# Altium project Solar_ESC_AM32.PrjPcb
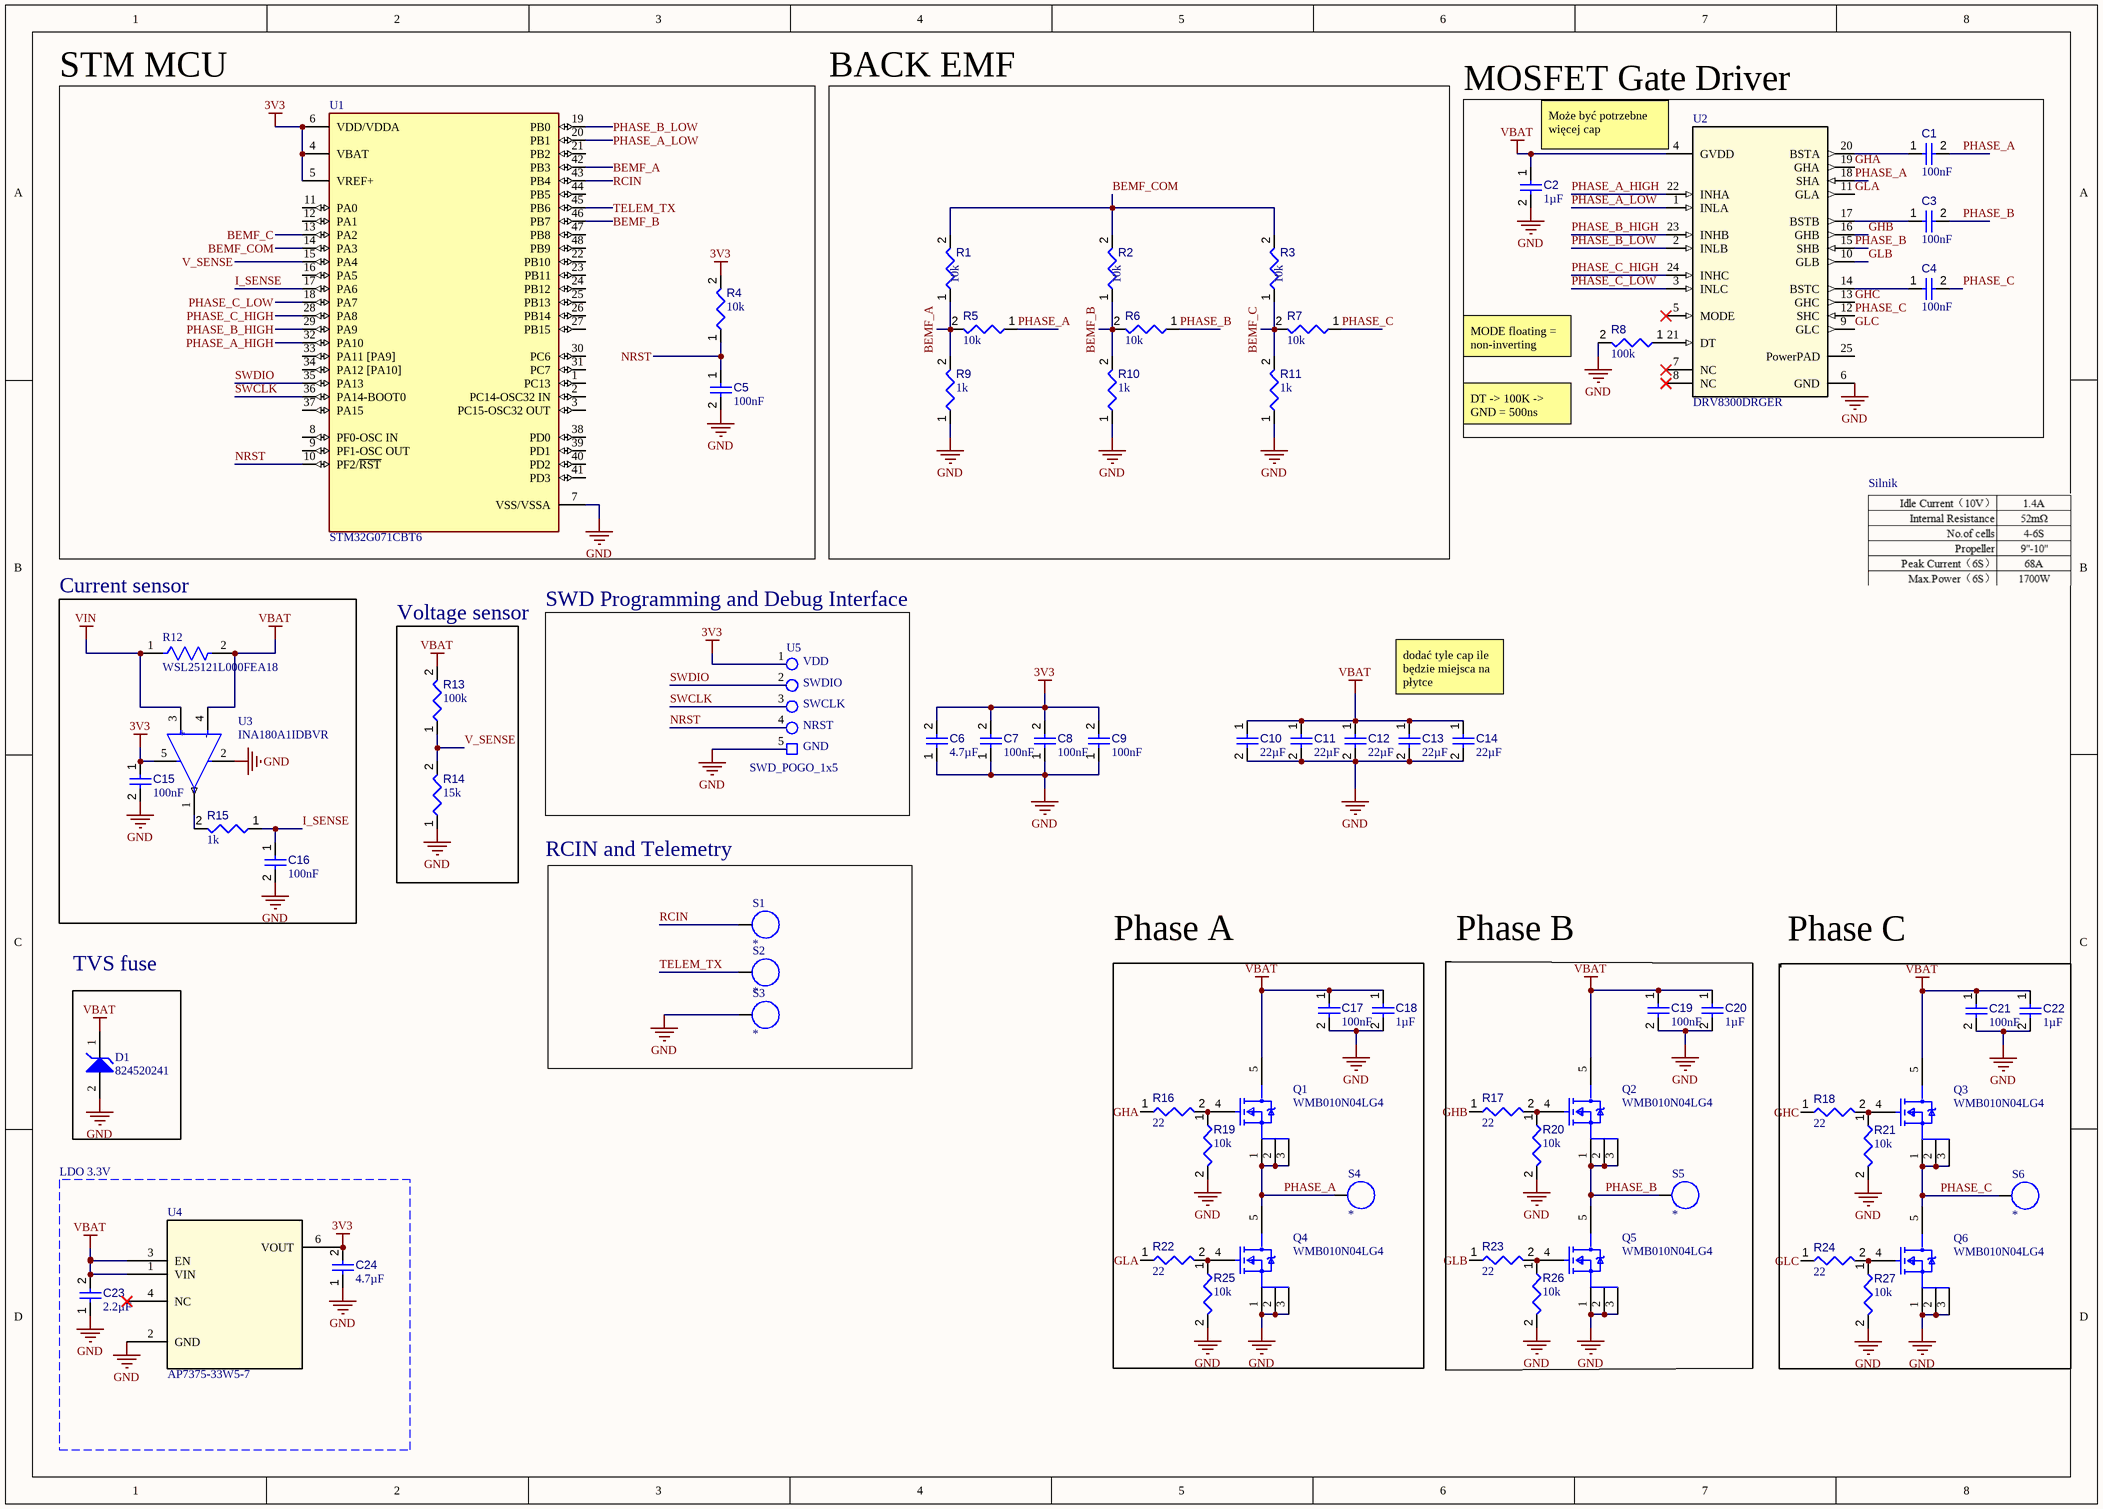
[diagram p0: Solar_ESC_AM32.SchDoc]
CAGE_CODE: ?????; CONTRACT_NUMBER: <CONTRACT NO>; DOC_NO_ASSY_DWG: <ASSY DWG NO>; DOC_NO_BOM: <BOM DOC NO>; DOC_NO_FAB_DWG: <FAB DWG NO>; DOC_NO_SCH_DWG: <SCH DWG NO>; PCB_2_DEC_TOL: +/-.01; PCB_3_DEC_TOL: +/-.010; PCB_ANG_TOL: +/-1/2; PCB_ASSEMBLY_NO: <PCB ASSY NO>; PCB_CHECKER: - -----; PCB_CHECKER_APP_DATE: --/--/----; PCB_DESIGNER: - -----; PCB_DESIGNER_APP_DATE: --/--/----; PCB_DWG_NO: <PCB DWG NO>; PCB_ENGINEER: - -----; PCB_ENGINEER_APP_DATE: --/--/----; PCB_PART_NUMBER: <PCB PN>; PCB_REV: A; SCH_REV: A
1 sheet, 69 parts. Net scope: global (net labels, ports and power ports of the same name join across sheets).
Board file: Solar_ESC_AM32.PcbDoc

## Sheet Solar_ESC_AM32.SchDoc: ESC na jeden silnik do drona
size A3; SheetNumber: 1; SheetTotal: 1; ENG_APP_DATE: --/--/--; DSN_APP_DATE: --/--/--; CHK_APP_DATE: --/--/--

### Parts
C1  value 100nF  [CAPC0805(2012)145_L]  (hidden comment: Capacitor 0.1µF +/-40% 25V 0805)
C2  value 1µF  [CAPC0805(2012)145_L]  (hidden comment: Capacitor 1µF +/-40% 25V 0805)
C3  value 100nF  [CAPC0805(2012)145_L]  (hidden comment: Capacitor 0.1µF +/-40% 25V 0805)
C4  value 100nF  [CAPC0805(2012)145_L]  (hidden comment: Capacitor 0.1µF +/-40% 25V 0805)
C5  value 100nF  [CAPC0805(2012)145_L]  (hidden comment: Capacitor 100nF +/-40% 6.3V 0805)
C6  value 4.7µF  [CAPC0805(2012)145_L]  (hidden comment: Capacitor 4.7µF +/-40% 25V 0805)
C7  value 100nF  [CAPC0805(2012)145_L]  (hidden comment: Capacitor 0.1µF +/-40% 25V 0805)
C8  value 100nF  [CAPC0805(2012)145_L]  (hidden comment: Capacitor 0.1µF +/-40% 25V 0805)
C9  value 100nF  [CAPC0805(2012)145_L]  (hidden comment: Capacitor 0.1µF +/-40% 25V 0805)
C10  value 22µF  [CAPC0805(2012)145_L]  (hidden comment: Capacitor 22µF +/-40% 16V 0805)
C11  value 22µF  [CAPC0805(2012)145_L]  (hidden comment: Capacitor 22µF +/-40% 16V 0805)
C12  value 22µF  [CAPC0805(2012)145_L]  (hidden comment: Capacitor 22µF +/-40% 16V 0805)
C13  value 22µF  [CAPC0805(2012)145_L]  (hidden comment: Capacitor 22µF +/-40% 16V 0805)
C14  value 22µF  [CAPC0805(2012)145_L]  (hidden comment: Capacitor 22µF +/-40% 16V 0805)
C15  value 100nF  [CAPC0805(2012)145_L]  (hidden comment: Capacitor 0.1µF +/-40% 25V 0805)
C16  value 100nF  [CAPC0805(2012)145_L]  (hidden comment: Capacitor 0.1µF +/-40% 25V 0805)
C17  value 100nF  [CAPC0805(2012)145_L]  (hidden comment: Capacitor 100nF +/-40% 6.3V 0805)
C18  value 1µF  [CAPC0805(2012)145_L]  (hidden comment: Capacitor 1µF +/-40% 25V 0805)
C19  value 100nF  [CAPC0805(2012)145_L]  (hidden comment: Capacitor 100nF +/-40% 6.3V 0805)
C20  value 1µF  [CAPC0805(2012)145_L]  (hidden comment: Capacitor 1µF +/-40% 25V 0805)
C21  value 100nF  [CAPC0805(2012)145_L]  (hidden comment: Capacitor 100nF +/-40% 6.3V 0805)
C22  value 1µF  [CAPC0805(2012)145_L]  (hidden comment: Capacitor 1µF +/-40% 25V 0805)
C23  value 2.2µF  [CAPC0805(2012)145_L]  (hidden comment: Capacitor 2.2µF +/-40% 35V 0805)
C24  value 4.7µF  [CAPC0805(2012)145_L]  (hidden comment: Capacitor 4.7µF +/-40% 25V 0805)
D1  824520241  [WE-TVSP_DO-214AA_Unidirectional]
Q1  WMB010N04LG4  [TRANS_CMS42N10H8-HF]
Q2  WMB010N04LG4  [TRANS_CMS42N10H8-HF]
Q3  WMB010N04LG4  [TRANS_CMS42N10H8-HF]
Q4  WMB010N04LG4  [TRANS_CMS42N10H8-HF]
Q5  WMB010N04LG4  [TRANS_CMS42N10H8-HF]
Q6  WMB010N04LG4  [TRANS_CMS42N10H8-HF]
R1  value 10k  [RESC0402(1005)_L]  (hidden comment: Resistor 10K  +/-1 % 0402 63 mW)
R2  value 10k  [RESC0402(1005)_L]  (hidden comment: Resistor 10K  +/-1 % 0402 63 mW)
R3  value 10k  [RESC0402(1005)_L]  (hidden comment: Resistor 10K  +/-1 % 0402 63 mW)
R4  value 10k  [RESC0402(1005)_L]  (hidden comment: Resistor 10K  +/-1 % 0402 63 mW)
R5  value 10k  [RESC0402(1005)_L]  (hidden comment: Resistor 10K  +/-1 % 0402 63 mW)
R6  value 10k  [RESC0402(1005)_L]  (hidden comment: Resistor 10K  +/-1 % 0402 63 mW)
R7  value 10k  [RESC0402(1005)_L]  (hidden comment: Resistor 10K  +/-1 % 0402 63 mW)
R8  value 100k  [RESC0402(1005)_L]  (hidden comment: Resistor 100K +/-1 % 0402 63 mW)
R9  value 1k  [RESC0402(1005)_L]  (hidden comment: Resistor 1K +/-5 % 0402 63 mW)
R10  value 1k  [RESC0402(1005)_L]  (hidden comment: Resistor 1K +/-5 % 0402 63 mW)
R11  value 1k  [RESC0402(1005)_L]  (hidden comment: Resistor 1K +/-5 % 0402 63 mW)
R12  WSL25121L000FEA18  [FP-WSL2512-MFG]
R13  value 100k  [RESC0402(1005)_L]  (hidden comment: Resistor 100K +/-1 % 0402 63 mW)
R14  value 15k  [RESC0402(1005)_L]  (hidden comment: Resistor 15K +/-1 % 0402 63 mW)
R15  value 1k  [RESC0402(1005)_L]  (hidden comment: Resistor 1K +/-5 % 0402 63 mW)
R16  value 22  [RESC1609X50X30ML08T20]  (hidden comment: Resistor 22R +/-1% 0603 100 mW)
R17  value 22  [RESC1609X50X30ML08T20]  (hidden comment: Resistor 22R +/-1% 0603 100 mW)
R18  value 22  [RESC1609X50X30ML08T20]  (hidden comment: Resistor 22R +/-1% 0603 100 mW)
R19  value 10k  [RESC0402(1005)_L]  (hidden comment: Resistor 10K  +/-1 % 0402 63 mW)
R20  value 10k  [RESC0402(1005)_L]  (hidden comment: Resistor 10K  +/-1 % 0402 63 mW)
R21  value 10k  [RESC0402(1005)_L]  (hidden comment: Resistor 10K  +/-1 % 0402 63 mW)
R22  value 22  [RESC1609X50X30ML08T20]  (hidden comment: Resistor 22R +/-1% 0603 100 mW)
R23  value 22  [RESC1609X50X30ML08T20]  (hidden comment: Resistor 22R +/-1% 0603 100 mW)
R24  value 22  [RESC1609X50X30ML08T20]  (hidden comment: Resistor 22R +/-1% 0603 100 mW)
R25  value 10k  [RESC0402(1005)_L]  (hidden comment: Resistor 10K  +/-1 % 0402 63 mW)
R26  value 10k  [RESC0402(1005)_L]  (hidden comment: Resistor 10K  +/-1 % 0402 63 mW)
R27  value 10k  [RESC0402(1005)_L]  (hidden comment: Resistor 10K  +/-1 % 0402 63 mW)
S1  *  [SOLDER_PAD_SIGNAL]
S2  *  [SOLDER_PAD_SIGNAL]
S3  *  [SOLDER_PAD_SIGNAL]
S4  *  [SOLDER_PAD_PHASE]
S5  *  [SOLDER_PAD_PHASE]
S6  *  [SOLDER_PAD_PHASE]
U1  STM32G071CBT6  [FP-LQFP48-5B-MFG]
U2  DRV8300DRGER  [RGE0024B-IPC_B]
U3  INA180A1IDBVR  [FP-DBV0005A-IPC_A]
U4  AP7375-33W5-7  [SOT25_AP7375-33W5-7_DIO]
U5  SWD_POGO_1x5  [SWD_pogo_testpoints]

### Blocks framed on the sheet
STM MCU: C5 R4 U1
BACK EMF: R1-R3 R5-R7 R9-R11
MOSFET Gate Driver: C1-C4 R8 U2
Current sensor: C15 C16 R12 R15 U3
Voltage sensor: R13 R14
SWD Programming and Debug Interface: U5
RCIN and Telemetry: S1-S3
TVS fuse: D1
Phase A: C17 C18 Q1 Q4 R16 R19 R22 R25 S4
Phase B: C19 C20 Q2 Q5 R17 R20 R23 R26 S5
LDO 3.3V: C23 C24 U4

### Nets
3V3: C6.2 C7.2 C8.2 C9.2 C15.1 C24.2 R4.2 U1.4(VBAT) U1.5(VREF+) U1.6(VDD/VDDA) U3.5(VS) U4.6(VOUT) U5.1(VCC)
GND: C2.2 C5.2 C6.1 C7.1 C8.1 C9.1 C10.2 C11.2 C12.2 C13.2 C14.2 C15.2 C16.2 C17.2 C18.2 C19.2 C20.2 C21.2 C22.2 C23.1 C24.1 D1.2(A) Q4.1(S) Q4.2(S) Q4.3(S) Q5.1(S) Q5.2(S) Q5.3(S) Q6.1(S) Q6.2(S) Q6.3(S) R8.2 R9.1 R10.1 R11.1 R14.1 R19.2 R20.2 R21.2 R25.2 R26.2 R27.2 S3.1 U1.7(VSS/VSSA) U2.6(GND) U3.2(GND) U4.2(GND) U5.5(GND)
VBAT: C2.1 C10.1 C11.1 C12.1 C13.1 C14.1 C17.1 C18.1 C19.1 C20.1 C21.1 C22.1 C23.2 D1.1(K) Q1.5(D) Q2.5(D) Q3.5(D) R12.2 R13.2 U2.4(GVDD) U3.4(IN-) U4.1(VIN) U4.3(EN)
VIN: R12.1 U3.3(IN+)
BEMF_A: R1.1 R5.2 R9.2 U1.42(PB3)
BEMF_B: R2.1 R6.2 R10.2 U1.46(PB7)
BEMF_C: R3.1 R7.2 R11.2 U1.13(PA2)
BEMF_COM: R1.2 R2.2 R3.2 U1.14(PA3)
GHA: R16.1 U2.19(GHA)
GHB: R17.1 U2.16(GHB)
GHC: R18.1 U2.13(GHC)
GLA: R22.1 U2.11(GLA)
GLB: R23.1 U2.10(GLB)
GLC: R24.1 U2.9(GLC)
I_SENSE: C16.1 R15.1 U1.17(PA6)
NRST: C5.1 R4.1 U1.10(PF2/~{RST}) U5.4(NRST)
PHASE_A: C1.2 Q1.1(S) Q1.2(S) Q1.3(S) Q4.5(D) R5.1 S4.1 U2.18(SHA)
PHASE_A_HIGH: U1.32(PA10) U2.22(INHA)
PHASE_A_LOW: U1.20(PB1) U2.1(INLA)
PHASE_B: C3.2 Q2.1(S) Q2.2(S) Q2.3(S) Q5.5(D) R6.1 S5.1 U2.15(SHB)
PHASE_B_HIGH: U1.29(PA9) U2.23(INHB)
PHASE_B_LOW: U1.19(PB0) U2.2(INLB)
PHASE_C: C4.2 Q3.1(S) Q3.2(S) Q3.3(S) Q6.5(D) R7.1 S6.1 U2.12(SHC)
PHASE_C_HIGH: U1.28(PA8) U2.24(INHC)
PHASE_C_LOW: U1.18(PA7) U2.3(INLC)
RCIN: S1.1 U1.43(PB4)
SWCLK: U1.36(PA14-BOOT0) U5.3(SWCLK)
SWDIO: U1.35(PA13) U5.2(SWDIO)
TELEM_TX: S2.1 U1.45(PB6)
V_SENSE: R13.1 R14.2 U1.15(PA4)
NetC1_1: C1.1 U2.20(BSTA)
NetC3_1: C3.1 U2.17(BSTB)
NetC4_1: C4.1 U2.14(BSTC)
NetQ1_4: Q1.4(G) R16.2 R19.1
NetQ2_4: Q2.4(G) R17.2 R20.1
NetQ3_4: Q3.4(G) R18.2 R21.1
NetQ4_4: Q4.4(G) R22.2 R25.1
NetQ5_4: Q5.4(G) R23.2 R26.1
NetQ6_4: Q6.4(G) R24.2 R27.1
NetR8_1: R8.1 U2.21(DT)
NetR15_2: R15.2 U3.1(OUT)

Not connected (* = marked no-connect by the designer): U1 1(PC13) 2(PC14-OSC32_IN) 3(PC15-OSC32_OUT) 8(PF0-OSC_IN) 9(PF1-OSC_OUT) 11(PA0) 12(PA1) 16(PA5) 21(PB2) 22(PB10) 23(PB11) 24(PB12) 25(PB13) 26(PB14) 27(PB15) 30(PC6) 31(PC7) 33(PA11_[PA9]) 34(PA12_[PA10]) 37(PA15) 38(PD0) 39(PD1) 40(PD2) 41(PD3) 44(PB5) 47(PB8) 48(PB9); U2 5(MODE)* 7(NC)* 8(NC)* 25(PowerPAD); U4 4(NC)*

### Notes on the sheet
- Może być potrzebne więcej cap
- (near R8) MODE floating = non-inverting INLx
- DT -> 100K -> GND = 500ns deadtime
- Silnik
- dodać tyle cap ile będzie miejsca na płytce
- Phase C
- Title:
- File name:
- Author:
- Reviewed by:
- Last Update:
- Project name:
- Sheet
- out of
- (in symbol CMP-04895-000140-1) +; -
- (in symbol SWD_POGO_1x5) VDD

### Library data of the parts
C1 C3 C4 C7-C9 C15 C16 = CMP-001-00091-1: Chip Capacitor, 0.1µF +/-40%, 25V, 0805, Thickness 1.45 mm; Tolerance: 20%; Mounting Technology: SMT; Max Operating Temperature: 85°C; Pins: 2; Voltage Rating: 25V; Case/Package: 0805; Min Operating Temperature: -55°C
C2 C18 C20 C22 = CMP-001-00091-2: Chip Capacitor, 1µF +/-40%, 25V, 0805, Thickness 1.45 mm; Tolerance: 20%; Pins: 2; Mounting Technology: SMT; Min Operating Temperature: -55°C; Case/Package: 0805; Max Operating Temperature: 85°C; Voltage Rating: 25V
C5 C17 C19 C21 = CMP-001-00085-1: Chip Capacitor, 100nF +/-40%, 6.3V, 0805, Thickness 1.45 mm; Tolerance: 10%; Case/Package: 0805; Max Operating Temperature: 85°C; Mounting Technology: SMT; Min Operating Temperature: -55°C; Voltage Rating: 6.3V; Pins: 2
C6 C24 = CMP-001-00080-4: Chip Capacitor, 4.7µF +/-40%, 25V, 0805, Thickness 1.45 mm; Tolerance: 20%; Voltage Rating: 25V; Min Operating Temperature: -55°C; Max Operating Temperature: 85°C; Pins: 2; Mounting Technology: SMT; Case/Package: 0805
C10-C14 = CMP-001-00081-4: Chip Capacitor, 22µF +/-40%, 16V, 0805, Thickness 1.45 mm; Tolerance: 5%; Voltage Rating: 16V; Mounting Technology: SMT; Pins: 2; Max Operating Temperature: 85°C; Case/Package: 0805; Min Operating Temperature: -55°C
C23 = CMP-001-00089-1: Chip Capacitor, 2.2µF +/-40%, 35V, 0805, Thickness 1.45 mm; Tolerance: 20%; Pins: 2; Max Operating Temperature: 85°C; Mounting Technology: SMT; Voltage Rating: 35V; Min Operating Temperature: -55°C; Case/Package: 0805
D1 = CMP-03913-71101587-2: TVS diode [Würth Elektronik] 824520241 TVS diode; Reverse Standoff Voltage: 24V; Polarity: Unidirectional; Peak Pulse Power: 600W; Leakage Current: 1µA; Power Line Protection: No; Clamping Voltage: 38.9V; Breakdown Voltage: 28.1V; Peak Pulse Current: 15.5A; Number of Unidirectional Channels: 1; Max Operating Temperature: 150°C; Packaging: Cut Tape; Composition: Zener; Length: 4.32mm; RoHS: Compliant; Min Operating Temperature: -65°C; Min Breakdown Voltage: 28.1V; Max Breakdown Voltage: 28.1V; Width: 3.62mm; Mount: Surface Mount; Height: 2.4mm; Number of Pins: 2
Q1-Q6 = WMB010N04LG4: N-MOSFET; unipolar; 40V; 268A; Idm: 1072A; 114W; Max Power Dissipation: 96W; Continuous Drain Current (ID): 217A; Rds On Max: 1.2mR; Input Capacitance: 6.68nF; Max Operating Temperature: 150°C; Lead Free: Lead Free; Packaging: Tape and Reel; Max Dual Supply Voltage: 40V; Drain to Source Voltage (Vdss): 40V; Mount: Surface Mount; Halogen Free: Halogen Free; Min Operating Temperature: -55°C
R1-R7 R19-R21 R25-R27 = CMP-009-00149-3: Chip Resistor, 10 kOhms, +/-1 %, 63 mW, -55 to 125 degC, 0402; Power: 63mW; Tolerance: 1%; Min Operating Temperature: -55°C; Case/Package: 0402; Max Operating Temperature: 155°C; Pins: 2
R8 R13 = CMP-009-00168-3: Chip Resistor, 100 kOhms, +/-1 %, 63 mW, -55 to 155 degC, 0402; Tolerance: 1%; Power: 63mW; Max Operating Temperature: 155°C; Min Operating Temperature: -55°C; Pins: 2; Case/Package: 0402
R9-R11 R15 = CMP-009-00157-3: Chip Resistor, 1 kOhms, +/-5 %, 63 mW, -55 to 155 degC, 0402; Tolerance: 5%; Power: 63mW; Case/Package: 0402; Pins: 2; Min Operating Temperature: -55°C; Max Operating Temperature: 155°C
R12 = CMP-00030-41947086-1: WSL25121L000FEA18 Res Metal Strip 2512 0.001 Ohm 1% 2W ±275ppm/C Sulfur Resistant Pad SMD Automotive T/R; Resistance: 1mΩ; Temperature Coefficient: 275ppm/°C; Termination: SMD/SMT; Weight: 63.58798mg; Min Operating Temperature: -65°C; RoHS: Compliant; Case/Package: 2512; Max Power Dissipation: 2W; Case Code (Imperial): 2512; Lead Free: Lead Free; Radiation Hardening: No; Height: 889µm; Number of Pins: 2512; Tolerance: 1%; Case Code (Metric): 6432; Schedule B: 8533210045, 8533210045; Length: 6.35mm; Packaging: Tape and Reel; Number of Terminations: 2; Max Operating Temperature: 170°C; Width: 3.2mm; NexarPartId: 41947086; Features: Moisture Resistant; Composition: Metal Element; Contact Plating: Tin; Power Rating: 2W
R14 = CMP-009-00168-4: Chip Resistor, 15 kOhms, +/-1 %, 63 mW, -55 to 155 degC, 0402; Tolerance: 1%; Power: 63mW; Case/Package: 0402; Min Operating Temperature: -55°C; Max Operating Temperature: 155°C; Pins: 2
R16-R18 R22-R24 = CMP-009-00027-5: Chip Resistor, 22 Ohm, +/- 1%, 100 mW, -55 to 155 degC, 0603 (1608 Metric); Power: 100mW; Voltage Rating: 75V; Max Operating Temperature: 155°C; Min Operating Temperature: -55°C; Tolerance: 1%; RoHS Compliant: True; Mounting Technology: SM; Case/Package: 0603; Pins: 2
S1-S6 = SolderPad: Value: *; HelpURL: *; MPN: *; classname: *
U1 = CMP-12105-000052-1: IC MCU 32BIT 128KB FLASH 48LQFP; Manufacturer: STMicroelectronics; Max Junction Temp: +105°C; Number Of I2C Channels: 2; Number Of Adc Channels: 17; Frequency: 64MHz; Memory Size: 128KBytes; Interface: I2C,SPI,UART,USART,USB,LIN,IrDA,I2S,Other; Ram Size: 36KBytes; Min Supply Voltage: 1.55V; Number Of Cores: 1; Max Supply Voltage: 3.6V; Core Architecture: ARM Cortex-M0+; Standoff Height: 0.05mm; Number Of Timers/Counters: 12; Number Of I/Os: 44; Data Bus Width: 32bits; Number Of Uart Channels: 5; Temperature Range Low: -40°C; Package: LQFP48-5B; Lead Free: Yes; Temperature Range High: +85°C; Octopart: https://octopart.com/stm32g071cbt6-stmicroelectronics-96627027; Ambient Temperature Range Low: -40°C; Automotive: No; Device Class L1: Integrated Circuits (ICs); Height: 1.6mm; ComponentLink2URL: https://www.st.com/resource/en/datasheet/stm32g071cb.pdf; Manufacturer Part Number: STM32G071CBT6; Number Of Usb Channels: 2; Device Class L3: Microcontrollers; ComponentLink2Description: Datasheet; Number Of Spi Channels: 2; Memory Type: FLASH; Device Class L2: Embedded Processors and Controllers; Digikey Description: IC MCU 32BIT 128KB FLASH 48LQFP; Ambient Temperature Range High: +85°C; Category: IC; Number Of A/D Converters: 1; RoHS: TRUE; Temperature: -40°C to +85°C
U2 = DRV8300DRGER: 100-V max simple 3-phase gate driver with bootstrap diodes 24-VQFN -40 to 125; Manufacturer_Name: Texas Instruments; TYPE: TYPE; RefDes: RefDes; Copyright: Copyright (C) 2025 Ultra Librarian. All rights reserved.; Manufacturer_Part_Number: DRV8300DRGER
U3 = CMP-04895-000140-1: IC CURR SENSE 1 CIRCUIT SOT23-5; Input Bias Current: 100nA; Input Offset Voltage (Vos): 100uV; Number of Circuits: 1; Slew Rate: 2V/µs; -3db Bandwidth: 350kHz; Operating Supply Current: 260uA; Case/Package: SOT-23-5; Min Operating Temperature: -40°C; Mount: Surface Mount; Packaging: Tape and Reel; Max Operating Temperature: 125°C
U4 = AP7375-33W5-7: Description; Manufacturer_Name: Diodes Inc; Copyright: Copyright (C) 2026 Ultra Librarian. All rights reserved.; Manufacturer_Part_Number: AP7375-33W5-7; RefDes: RefDes; Type: Type